# EAGLE design BMS (EAGLE 9.6.2)
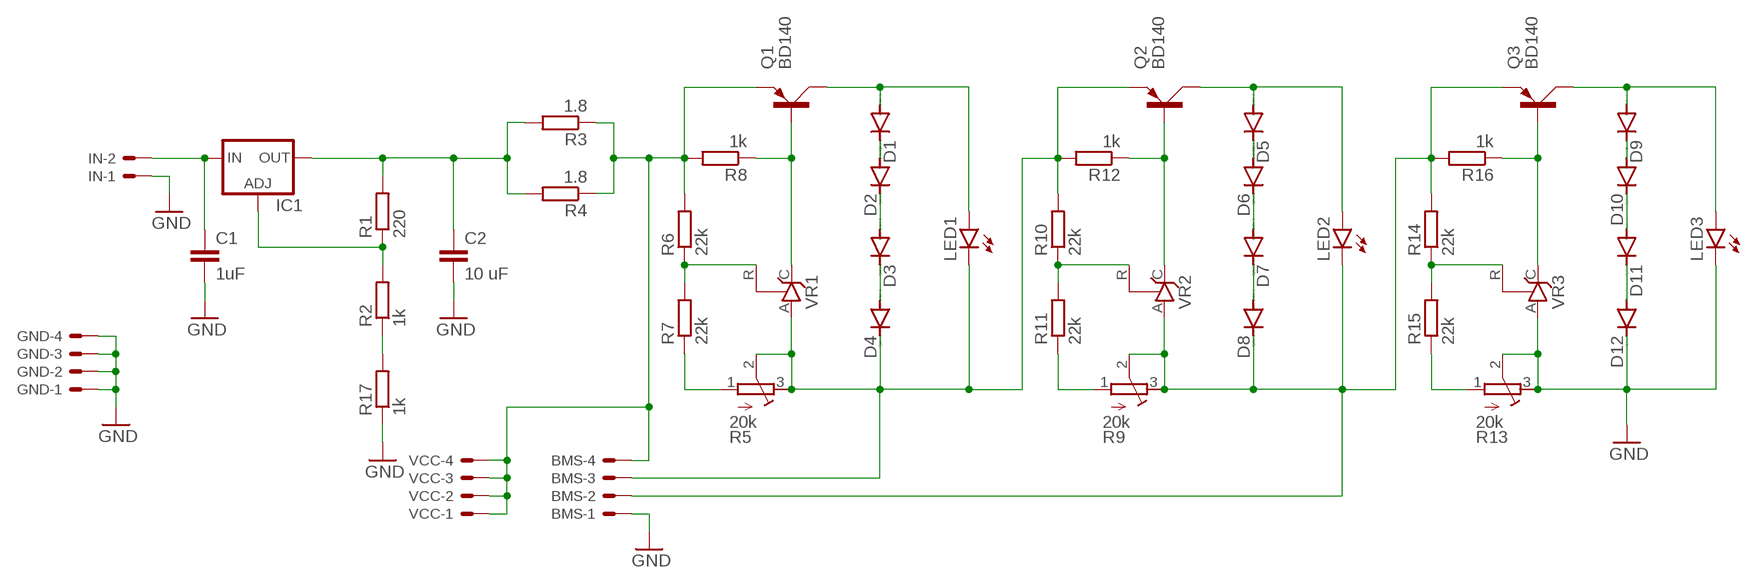
[diagram p0: schematic, sheet 1]

## Parts
BMS  22-23-2041  [22-23-2041]
C1  1uF  C-EU025-025X050  [C025-025X050]
C2  10 uF  C-EU025-025X050  [C025-025X050]
D1  1N4004  [DO41-10]
D2  1N4004  [DO41-10]
D3  1N4004  [DO41-10]
D4  1N4004  [DO41-10]
D5  1N4004  [DO41-10]
D6  1N4004  [DO41-10]
D7  1N4004  [DO41-10]
D8  1N4004  [DO41-10]
D9  1N4004  [DO41-10]
D10  1N4004  [DO41-10]
D11  1N4004  [DO41-10]
D12  1N4004  [DO41-10]
GND  22-23-2041  [22-23-2041]
IC1  LM317TS  [317TS]
IN  22-23-2021  [22-23-2021]
LED1  LED5MM  [LED5MM]
LED2  LED5MM  [LED5MM]
LED3  LED5MM  [LED5MM]
Q1  BD140  [TO126AV]
Q2  BD140  [TO126AV]
Q3  BD140  [TO126AV]
R1  220  R-EU_0207/10  [0207/10]
R2  1k  R-EU_0207/10  [0207/10]
R3  1.8  R-EU_0617/22  [0617/22]
R4  1.8  R-EU_0617/22  [0617/22]
R5  20k  R-TRIMM3296W  [RTRIM3296W]
R6  22k  R-EU_0207/10  [0207/10]
R7  22k  R-EU_0207/10  [0207/10]
R8  1k  R-EU_0207/10  [0207/10]
R9  20k  R-TRIMM3296W  [RTRIM3296W]
R10  22k  R-EU_0207/10  [0207/10]
R11  22k  R-EU_0207/10  [0207/10]
R12  1k  R-EU_0207/10  [0207/10]
R13  20k  R-TRIMM3296W  [RTRIM3296W]
R14  22k  R-EU_0207/10  [0207/10]
R15  22k  R-EU_0207/10  [0207/10]
R16  1k  R-EU_0207/10  [0207/10]
R17  1k  R-EU_0207/10  [0207/10]
VCC  22-23-2041  [22-23-2041]
VR1  TL431CLP  [TO92-CLP]
VR2  TL431CLP  [TO92-CLP]
VR3  TL431CLP  [TO92-CLP]

## Nets
GND: BMS.1 C1.2 C2.2 D12.C GND.1 GND.2 GND.3 GND.4 IN.1 LED3.K(C) R13.2(S) R13.3(E) R17.1 VR3.A
N$1: C2.1 IC1.2(OUT) R1.2 R3.2 R4.2
N$2: IC1.1(ADJ) R1.1 R2.2
N$4: R6.1 R7.2 VR1.R
N$5: BMS.4 Q1.E R3.1 R4.1 R6.2 R8.2 VCC.1 VCC.2 VCC.3 VCC.4
N$6: R5.1(A) R7.1
N$7: BMS.3 D4.C LED1.K(C) Q2.E R5.2(S) R5.3(E) R10.2 R12.2 VR1.A
N$8: Q1.B R8.1 VR1.C
N$9: D1.A LED1.A Q1.C
N$10: D1.C D2.A
N$11: D2.C D3.A
N$12: D3.C D4.A
N$13: C1.1 IC1.3(IN) IN.2
N$15: R10.1 R11.2 VR2.R
N$16: R9.1(A) R11.1
N$17: BMS.2 D8.C LED2.K(C) Q3.E R9.2(S) R9.3(E) R14.2 R16.2 VR2.A
N$18: Q2.B R12.1 VR2.C
N$19: D5.C D6.A
N$20: D6.C D7.A
N$21: D7.C D8.A
N$22: D5.A LED2.A Q2.C
N$23: R2.1 R17.2
N$24: R14.1 R15.2 VR3.R
N$25: R13.1(A) R15.1
N$27: Q3.B R16.1 VR3.C
N$28: D9.C D10.A
N$29: D10.C D11.A
N$30: D11.C D12.A
N$31: D9.A LED3.A Q3.C

## Library data of the parts
BMS GND VCC = con-molex:22-23-2041: .100" (2.54mm) Center Header - 4 Pin; MF: MOLEX; MPN: 22-23-2041; OC_FARNELL: 1462920; OC_NEWARK: 38C0355
C1 C2 = rcl:C-EU: CAPACITOR, European symbol; SPICEPREFIX: C
D1-D12 = diode:1N4004: DIODE general purpose rectifier, 1 A
IC1 = v-reg:LM317TS: VOLTAGE REGULATOR
IN = con-molex:22-23-2021: .100" (2.54mm) Center Header - 2 Pin; MF: MOLEX; MPN: 22-23-2021; OC_FARNELL: 1462926; OC_NEWARK: 25C3832
LED1-LED3 = led:LED: LED OSRAM: - CHIPLED LG R971, LG N971, LY N971, LG Q971, LY Q971, LO R971, LY R971 LH N974, LH R974 LS Q976, LO Q976, LY Q976 LO Q996 - Hyper CHIPLED LW Q18S LB Q993, LB Q99A, LB R99A - SideLED LS A670, LO A670, LY A670, LG A670, LP A670 LB A673, LV A673, LT A673, LW A673 LH A674 LY A675 LS A676, LA A676, LO A676, LY A676, LW A676 LS A679, LY A679, LG A679 - Hyper Micro SIDELED® LS Y876, LA Y876, LO Y876, LY Y876 LT Y87S - SmartLED LW L88C, LW L88S LB L89C, LB L89S, LG L890 LS L89K, LO L89K, LY L89K LS L896, LA L896, LO L896, LY L896 - TOPLED LS T670, LO T670, LY T670, LG T670, LP T670 LSG T670, LSP T670, LSY T670, LOP T670, LYG T670 LG T671, LOG T671, LSG T671 LB T673, LV T673, LT T673, LW T673 LH T674 LS T676, LA T676, LO T676, LY T676, LB T676, LH T676, LSB T676, LW T676 LB T67C, LV T67C, LT T67C, LS T67K, LO T67K, LY T67K, LW E67C LS E67B, LA E67B, LO E67B, LY E67B, LB E67C, LV E67C, LT E67C LW T67C LS T679, LY T679, LG T679 LS T770, LO T770, LY T770, LG T770, LP T770 LB T773, LV T773, LT T773, LW T773 LH T774 LS E675, LA E675, LY E675, LS T675 LS T776, LA T776, LO T776, LY T776, LB T776 LHGB T686 LT T68C, LB T68C - Hyper Mini TOPLED® LB M676 - Mini TOPLED Santana® LG M470 LS M47K, LO M47K, LY M47K Source: http://www.osram.convergy.de LUXEON: - LUMILED® LXK2-PW12-R00, LXK2-PW12-S00, LXK2-PW14-U00, LXK2-PW14-V00 LXK2-PM12-R00, LXK2-PM12-S00, LXK2-PM14-U00 LXK2-PE12-Q00, LXK2-PE12-R00, LXK2-PE12-S00, LXK2-PE14-T00, LXK2-PE14-U00 LXK2-PB12-K00, LXK2-PB12-L00, LXK2-PB12-M00, LXK2-PB14-N00, LXK2-PB14-P00, LXK2-PB14-Q00 LXK2-PR12-L00, LXK2-PR12-M00, LXK2-PR14-Q00, LXK2-PR14-R00 LXK2-PD12-Q00, LXK2-PD12-R00, LXK2-PD12-S00 LXK2-PH12-R00, LXK2-PH12-S00 LXK2-PL12-P00, LXK2-PL12-Q00, LXK2-PL12-R00 Source: www.luxeon.com KINGBRIGHT: KA-3528ASYC Source: www.kingbright.com
Q1-Q3 = transistor-power:BD140: PNP TRANSISTOR
R1-R4 R6-R8 R10-R12 R14-R17 = rcl:R-EU_: RESISTOR, European symbol; SPICEPREFIX: R
R5 R9 R13 = rcl:R-TRIMM: Trimm resistor; SPICEMODEL: X; SPICEPREFIXL: POT
VR1-VR3 = v-reg:TL431CLP: VOLTAGE REGULATOR

## Board
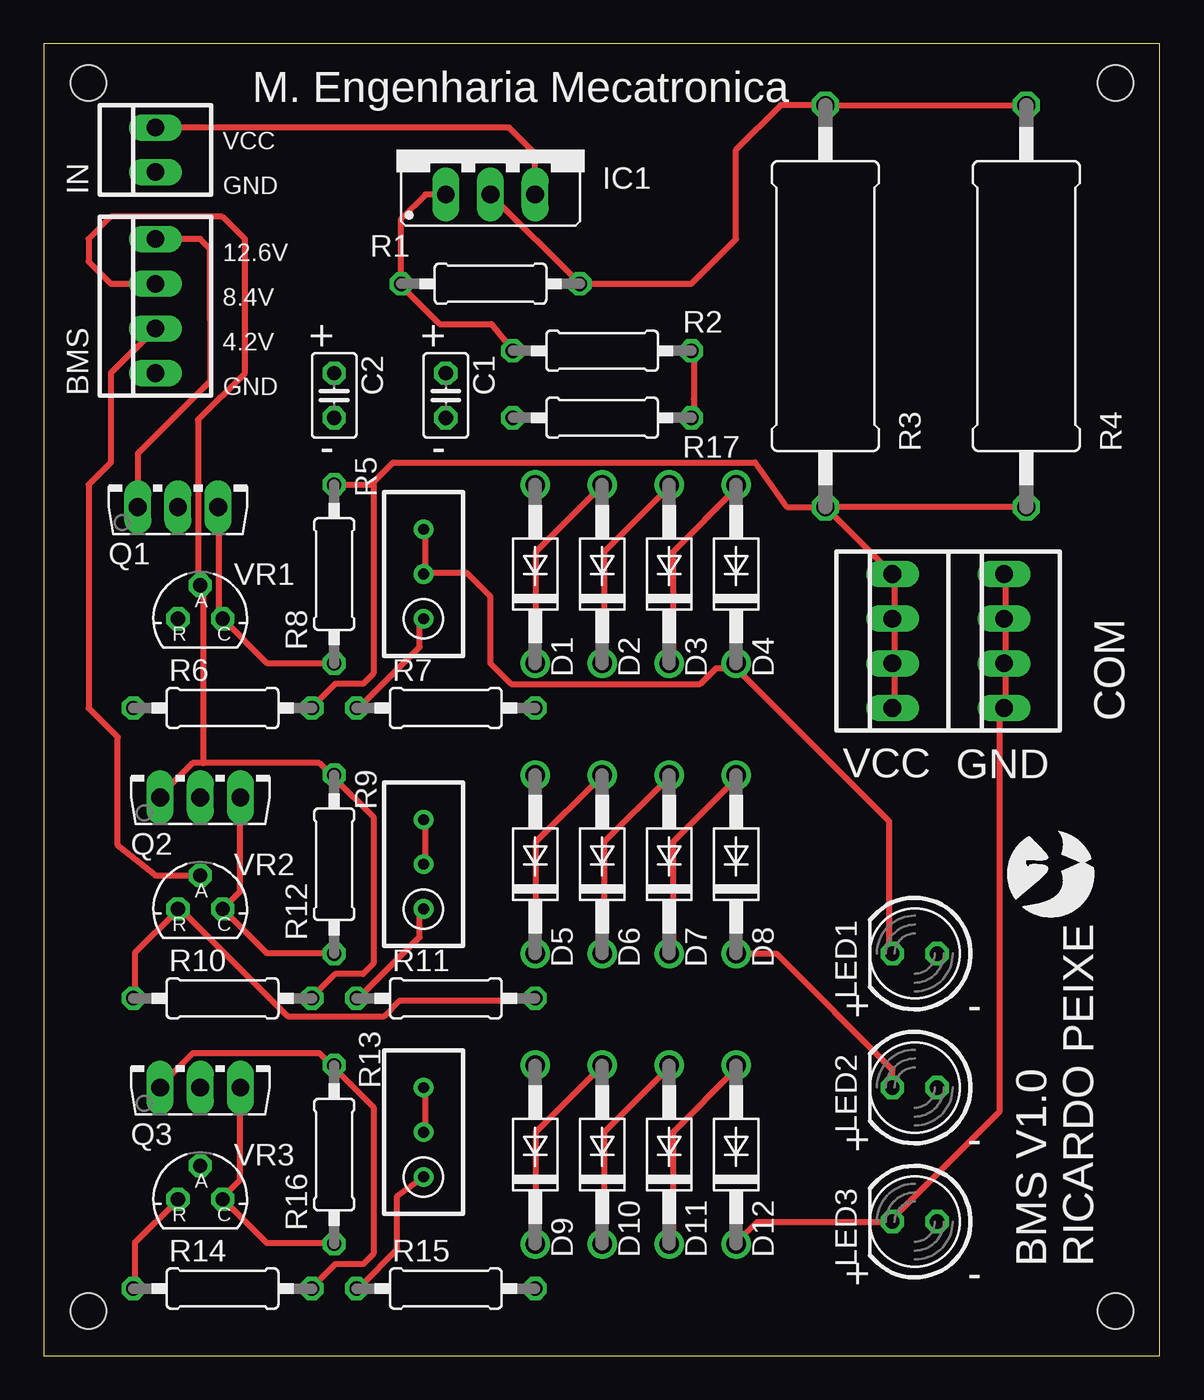
[diagram p1: board, top side]
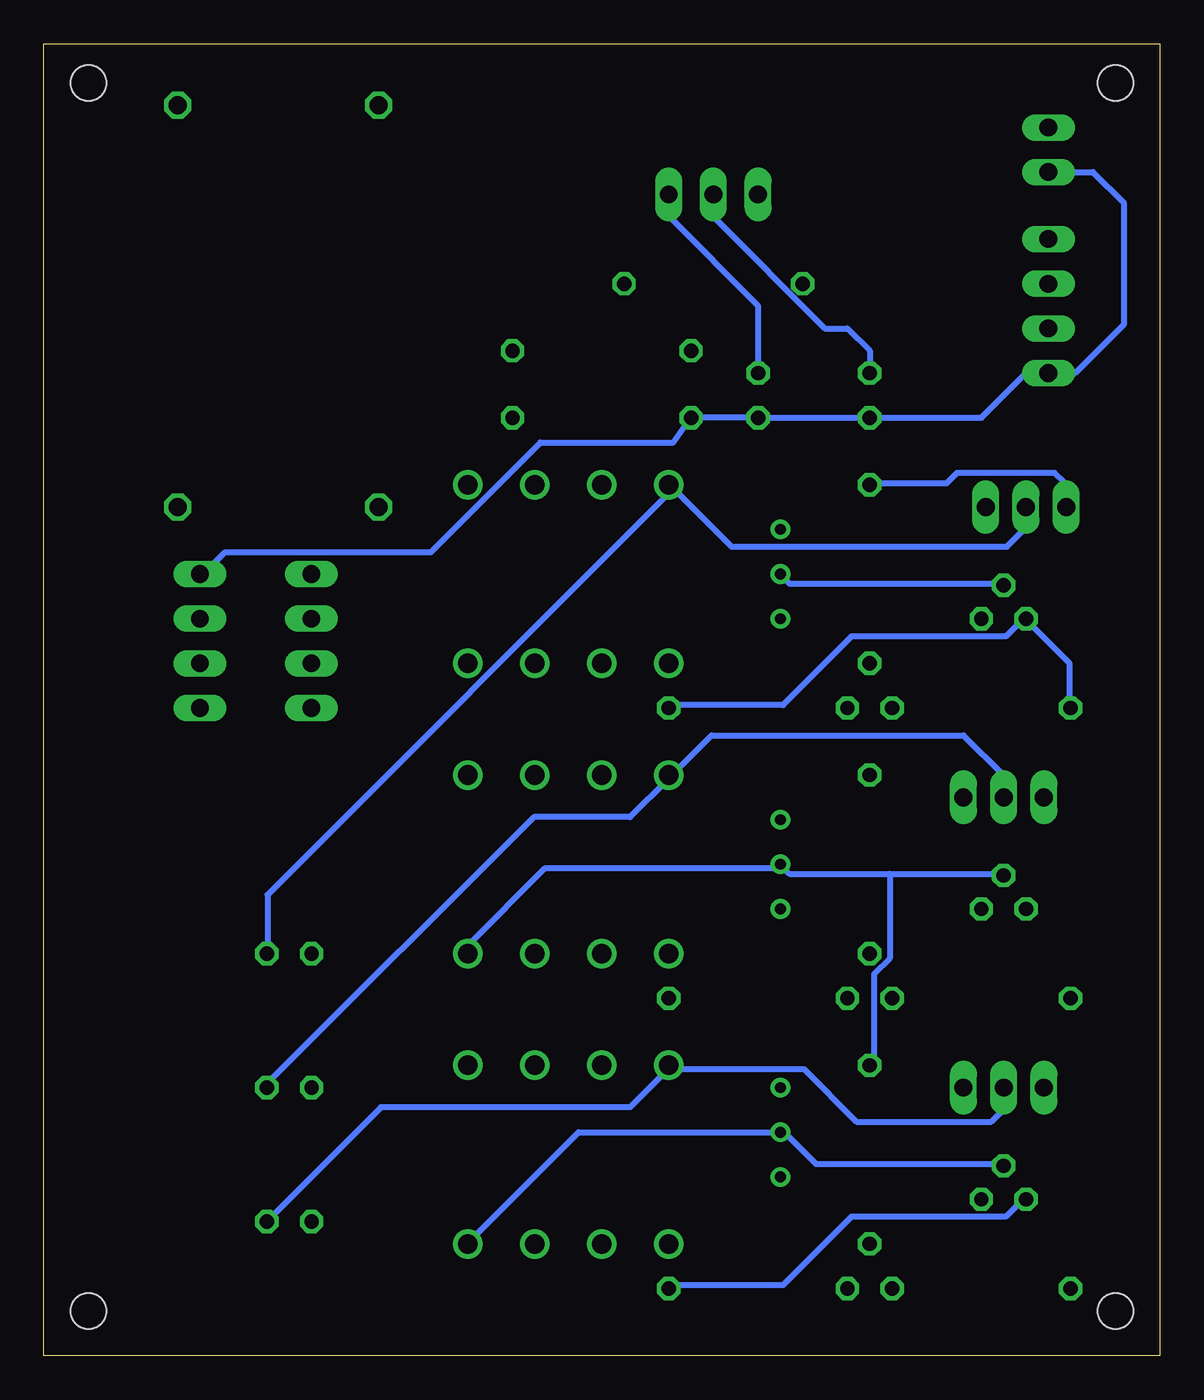
[diagram p2: board, bottom side, seen from below]

Size 63.48 x 74.6 mm. Coordinates in mm from the lower left corner, seen from the top.
Outline: 0,0 63.48,0 63.48,74.6 0,74.6 0,0
Copper layers (1*16): Top 0.035mm / dielectric 1.5mm / Bottom 0.035mm
Design rules "default": minimum track width 6mil, minimum drill 0.35mm, track to track 6mil, track to pad 6mil, pad to pad 6mil, via to via 6mil, smd to smd 6mil, copper to edge 40mil, drill to drill 6mil, minimum pad ring 10mil, minimum via ring 8mil, stop-mask expansion 4mil, vias tented up to drill 0mil, thermal gap 10mil
Holes 2.03 mm at 2.54,72.39 60.96,72.39 60.96,2.54 2.54,2.54

### Footprints (pad centres in the part's own frame; a part is rotated, then mirrored left to right if it is on the bottom)
22-23-2041 = drill 1 long: 1 -3.81,0; 2 -1.27,0; 3 1.27,0; 4 3.81,0
C025-025X050 = drill 0.813 octagon: 1 -1.27,0; 2 1.27,0
DO41-10 = drill 1.118: A 5.08,0; C -5.08,0
317TS = drill 1.016 long: 1 -2.54,-2.54; 2 0,-2.54; 3 2.54,-2.54
22-23-2021 = drill 1 long: 1 -1.27,0; 2 1.27,0
LED5MM = drill 0.813 octagon: A -1.27,0; K 1.27,0
TO126AV = drill 1.016 long: B 2.286,-1.27; C 0,-1.27; E -2.286,-1.27
0207/10 = drill 0.813 octagon: 1 -5.08,0; 2 5.08,0
0617/22 = drill 1.016 octagon: 1 -11.43,0; 2 11.43,0
RTRIM3296W = drill 0.61: 1 0,-2.54; 2 0,0; 3 0,2.54
TO92-CLP = drill 0.813 octagon: A 0,1.905; C 1.27,0; R -1.27,0

### Placement (x,y rotation side)
BMS  6.35,59.69 90 top
C1  22.86,54.61 270 top
C2  16.51,54.61 270 top
D1  27.94,44.45 90 top
D2  31.75,44.45 90 top
D3  35.56,44.45 90 top
D4  39.37,44.45 90 top
D5  27.94,27.94 90 top
D6  31.75,27.94 90 top
D7  35.56,27.94 90 top
D8  39.37,27.94 90 top
D9  27.94,11.43 90 top
D10  31.75,11.43 90 top
D11  35.56,11.43 90 top
D12  39.37,11.43 90 top
GND  54.61,40.64 90 top
IC1  25.4,68.58 0 top
IN  6.35,68.58 90 top
LED1  49.53,22.86 180 top
LED2  49.53,15.24 180 top
LED3  49.53,7.62 180 top
Q1  7.62,49.53 0 top
Q2  8.89,33.02 0 top
Q3  8.89,16.51 0 top
R1  25.4,60.96 0 top
R2  31.75,57.15 180 top
R3  44.45,59.69 90 top
R4  55.88,59.69 90 top
R5  21.59,44.45 0 top
R6  10.16,36.83 0 top
R7  22.86,36.83 0 top
R8  16.51,44.45 90 top
R9  21.59,27.94 0 top
R10  10.16,20.32 0 top
R11  22.86,20.32 0 top
R12  16.51,27.94 90 top
R13  21.59,12.7 0 top
R14  10.16,3.81 0 top
R15  22.86,3.81 0 top
R16  16.51,11.43 90 top
R17  31.75,53.34 0 top
VCC  48.26,40.64 90 top
VR1  8.89,41.91 0 top
VR2  8.89,25.4 0 top
VR3  8.89,8.89 0 top

### Tracks (layer width: path | path; a pad name or v marks a point on that pad's centre or on a via)
GND
  Top 0.35: R13.2 21.67,12.7 21.67,15.1 R13.3 | GND.4 54.67,44.2 54.67,42.1 GND.3 54.67,41.8 54.67,39.4 GND.2 54.67,39.1 54.67,37 GND.1 54.37,36.7 54.37,13.9 48.37,7.9 LED3.K 48.07,7.6 40.57,7.6 39.37,6.4 D12.C
  Bottom 0.35: IN.1 3.81,67.31 2.03,65.53 2.03,58.67 4.82,55.88 BMS.1 7.62,55.88 10.16,53.34 C2.2 C1.2 R17.1 27.68,51.93 35.24,51.93 41.47,45.7 53.17,45.7 54.37,44.5 GND.4 | VR3.A 9.07,10.9 19.57,10.9 21.37,12.7 R13.2 33.07,12.7 39.37,6.4 D12.C
N$1
  Top 0.35: R4.2 R3.2 41.91,71.12 39.37,68.58 39.37,63.5 36.83,60.96 R1.2 IC1.2
  Bottom 0.35: IC1.2 25.4,64.77 19.05,58.42 17.78,58.42 16.51,57.15 C2.1
N$2
  Top 0.35: R2.2 25.45,58.67 22.5,58.67 20.47,60.7 R1.1 20.32,64.66 21.7,66.04 IC1.1
N$4
  Bottom 0.35: R6.1 5.17,37 5.17,39.4 7.57,41.8 VR1.R 7.87,41.8 8.77,40.9 17.54,40.9 21.44,37 27.67,37 R7.2
N$5
  Top 0.35: VCC.1 48.37,37 48.37,39.1 VCC.2 48.37,39.4 48.37,41.8 VCC.3 48.37,42.1 48.37,44.2 VCC.4 R3.1 | 18.74,49.67 18.74,38.8 18.14,38.2 16.57,38.2 15.37,37 R6.2 | 18.74,49.67 19.87,50.8 40.46,50.8 42.27,48.26 R3.1 | Q1.E 5.33,51.31 9.46,55.43 9.46,58.42 9.46,58.87 9.46,62.93 8.89,63.5 BMS.4 | R4.1 R3.1 | 18.74,49.67 18.6,49.53 R8.2
  Bottom 0.35: R8.2 16.27,49.6 12.14,49.6 11.54,50.2 6,50.2 5.47,49.67 5.47,48.4 Q1.E
N$6
  Top 0.35: R5.1 21.37,41.8 21.37,40.3 18.07,37 R7.1
N$7
  Top 0.35: 39.37,39.1 48.07,30.4 48.07,22.9 LED1.K | R10.2 15.37,20.5 16.57,21.7 18.14,21.7 18.74,22.3 18.74,30.63 16.57,32.8 R12.2 16.27,33.1 15.67,33.7 9.07,33.7 | 9.07,33.7 8.47,33.7 6.67,31.9 Q2.E | 21.67,44.5 21.67,46.9 R5.3 | 21.67,44.5 R5.2 | 9.07,33.7 9.07,43.63 VR1.A 8.77,43.9 8.77,53.22 11.43,55.88 11.43,63.5 10.16,64.77 3.81,64.77 2.54,63.5 2.54,62.23 3.81,60.96 BMS.3 | 39.37,39.1 38.24,39.1 37.34,38.2 26.57,38.2 25.4,39.37 25.4,43.18 24.08,44.5 21.67,44.5 | 39.37,39.1 D4.C
  Bottom 0.35: VR1.A 9.07,43.9 21.07,43.9 21.37,44.2 R5.2
N$8
  Top 0.35: R8.1 16.27,39.4 12.67,39.4 VR1.C 9.97,42.1 9.97,48.1 Q1.B
N$9
  Bottom 0.35: 27.67,49.3 50.77,26.2 50.77,22.9 LED1.A | Q1.C 7.62,47.08 8.7,46 24.37,46 27.67,49.3 | 27.67,49.3 D1.A
N$10
  Top 0.35: D1.C 27.97,39.4 27.97,45.7 31.57,49.3 D2.A
N$11
  Top 0.35: D2.C 31.87,39.4 31.87,45.7 35.47,49.3 D3.A
N$12
  Top 0.35: D3.C 35.77,39.4 35.77,45.7 39.37,49.3 D4.A
N$13
  Top 0.35: IC1.3 27.94,68.37 26.46,69.85 IN.2
  Bottom 0.35: IC1.3 27.94,64.8 22.87,59.73 22.87,55.9 C1.1
N$15
  Top 0.35: R10.1 5.17,20.5 5.17,22.9 7.57,25.3 VR2.R 7.87,25.3 13.87,19.3 19.34,19.3 20.24,20.2 27.67,20.2 R11.2
N$16
  Top 0.35: R9.1 21.37,25.3 21.37,23.8 18.07,20.5 R11.1
N$17
  Top 0.35: R14.2 15.37,4 16.57,5.2 18.14,5.2 18.74,5.8 18.74,14.13 16.57,16.3 R16.2 16.27,16.6 15.67,17.2 8.47,17.2 6.67,15.4 Q3.E | LED2.K 48.26,16.25 41.65,22.86 D8.C | R9.2 21.67,28 21.67,30.4 R9.3 | VR2.A 6.35,27.3 4.2,29.01 4.2,35.17 2.54,36.83 2.54,49.53 3.81,50.8 3.81,55.88 BMS.2
  Bottom 0.35: 15.37,27.4 21.07,27.4 21.37,27.7 R9.2 21.67,27.7 35.01,27.7 39.37,23.34 D8.C | 15.37,27.4 9.07,27.4 VR2.A | 15.37,27.4 15.37,22.6 16.27,21.7 16.27,16.6 R16.2
N$18
  Top 0.35: R12.1 16.27,22.9 12.67,22.9 10.27,25.3 VR2.C 11.17,26.41 11.17,31.6 Q2.B
N$19
  Top 0.35: D5.C 27.97,22.9 27.97,29.2 31.57,32.8 D6.A
N$20
  Top 0.35: D6.C 31.87,22.9 31.87,29.2 35.47,32.8 D7.A
N$21
  Top 0.35: D7.C 35.77,22.9 35.77,29.2 39.37,32.8 D8.A
N$22
  Bottom 0.35: LED2.A 50.8,15.44 35.61,30.63 30.14,30.63 27.97,32.8 D5.A 27.67,33.1 25.5,35.27 11.17,35.27 8.89,32.99 Q2.C
N$23
  Top 0.35: R17.2 36.97,53.5 36.97,54.4 36.97,57.1 R2.1
N$24
  Top 0.35: R14.1 5.17,4 5.17,6.4 7.57,8.8 VR3.R
  Bottom 0.35: R15.2 27.67,4 21.44,4 17.54,7.9 8.77,7.9 7.87,8.8 VR3.R
N$25
  Top 0.35: R13.1 20.1,9.08 20.1,6.03 18.07,4 R15.1
N$27
  Top 0.35: R16.1 16.27,6.4 12.67,6.4 10.27,8.8 VR3.C 10.27,9.1 11.17,10 11.17,15.1 Q3.B
N$28
  Top 0.35: D9.C 27.97,6.4 27.97,12.7 31.57,16.3 D10.A
N$29
  Top 0.35: D10.C 31.87,6.4 31.87,12.7 35.47,16.3 D11.A
N$30
  Top 0.35: D11.C 35.77,6.4 35.77,12.7 39.37,16.3 D12.A
N$31
  Bottom 0.35: LED3.A 50.77,7.9 50.54,7.9 44.31,14.13 30.14,14.13 27.97,16.3 D9.A 27.67,16.3 20.26,16.3 17.26,13.3 9.6,13.3 8.89,14.01 Q3.C

### Text on the board
tNames: M. Engenharia Mecatronica | VCC | GND | 12.6V | 8.4V | 4.2V | + | + | GND | - | - | COM | + | - | + | - | BMS V1.0 / RICARDO PEIXE | + | -